# EAGLE schematic DetBackplaneSingleLayer01 (EAGLE 7.7.0)
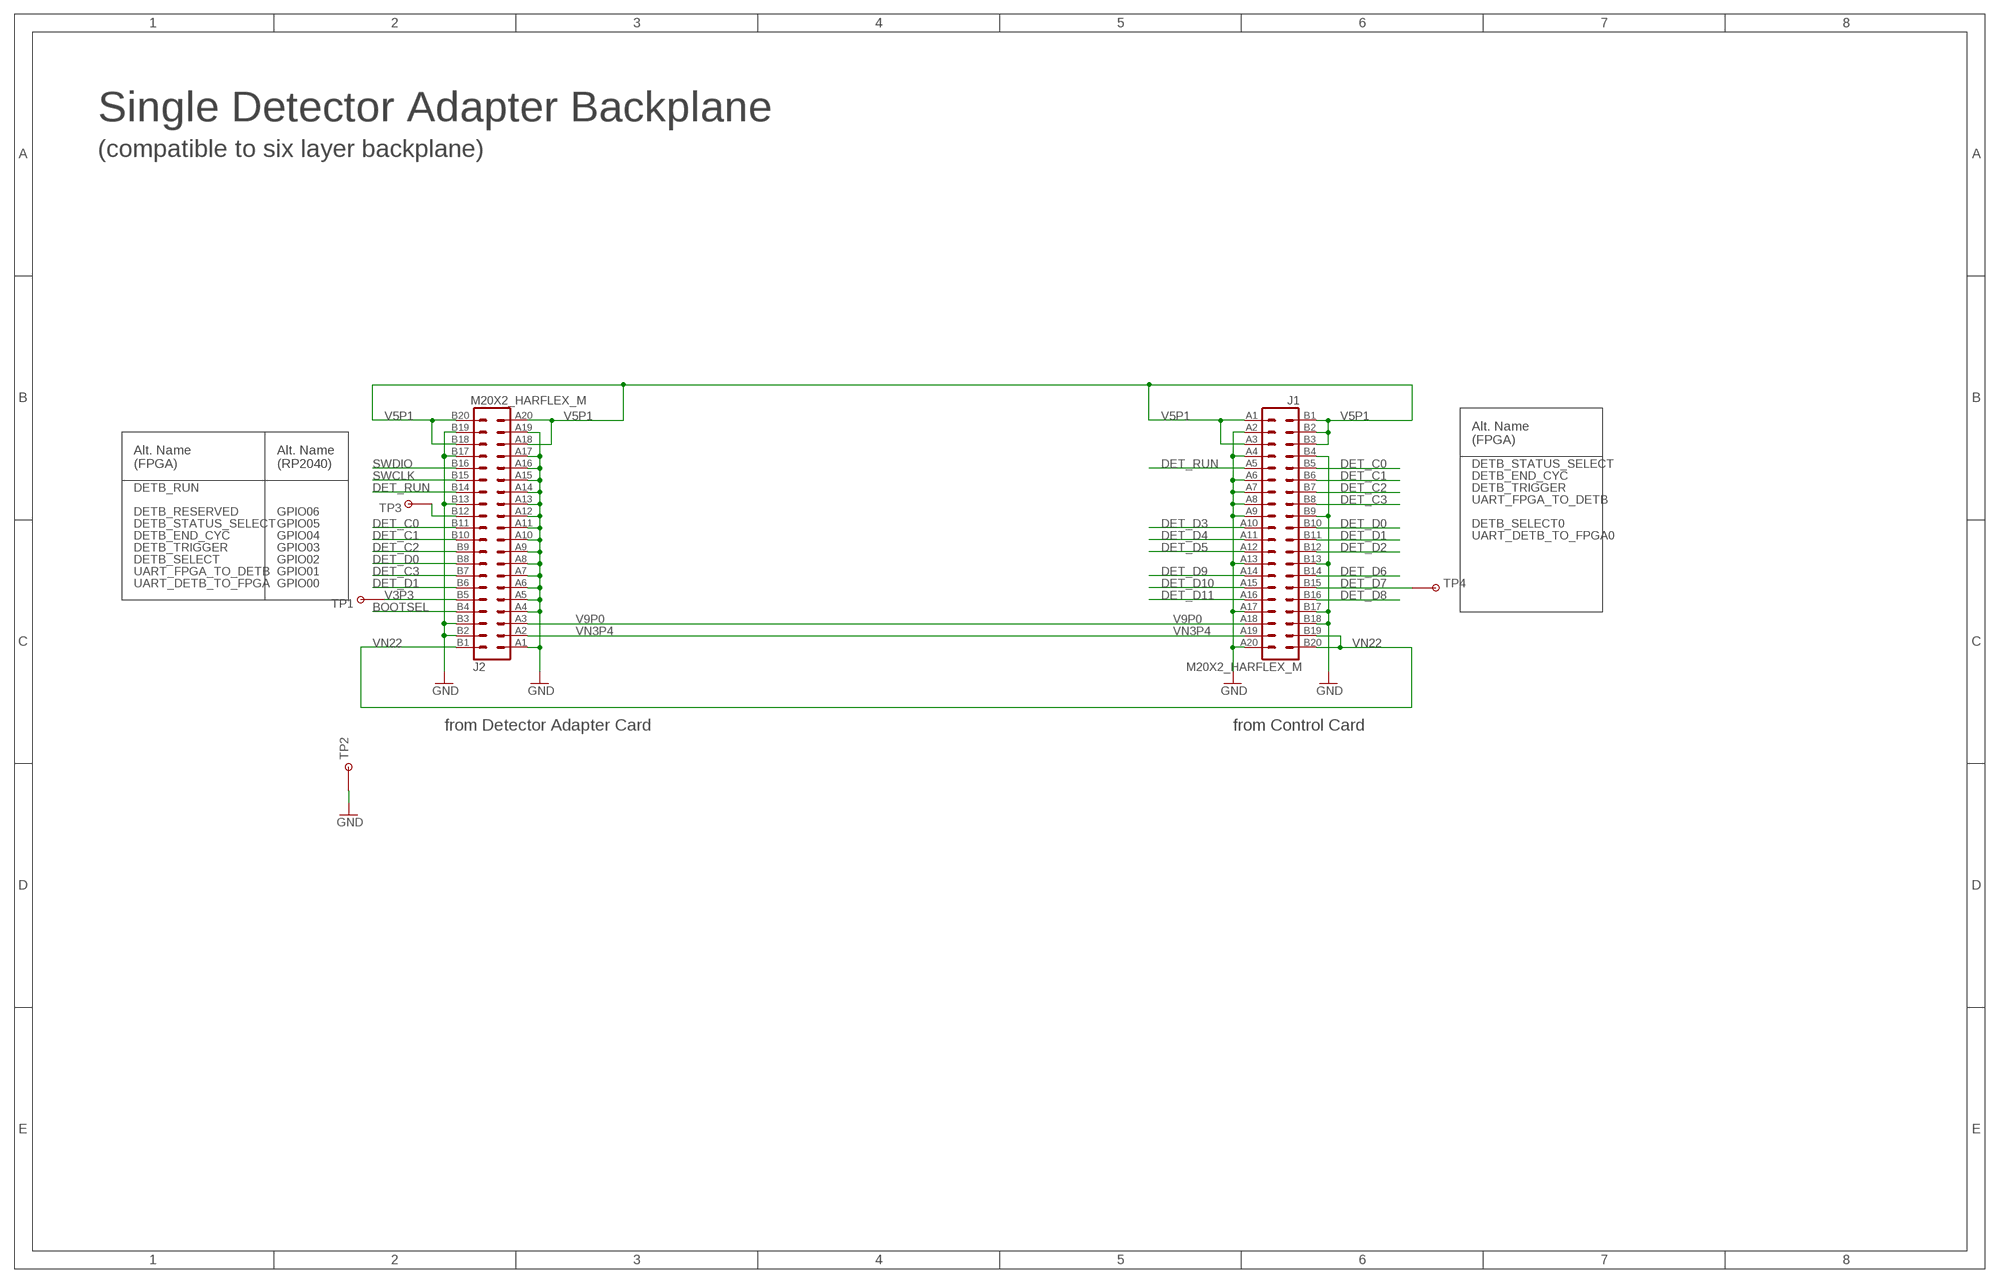
[diagram p0: schematic, sheet 1]

## Parts
J1  M20X2_HARFLEX_M  [M20X2_HARFLEX_M]
J2  M20X2_HARFLEX_M  [M20X2_HARFLEX_M]
TP1  TESTPOINT_ROUND  [TESTPAD_ROUND]
TP2  TESTPOINT1X01  [1X01]
TP3  TESTPOINT_ROUND  [TESTPAD_ROUND]
TP4  TESTPOINT_ROUND  [TESTPAD_ROUND]

## Nets
BOOTSEL: J2.B4
DET_C0: J1.B5 J2.B11
DET_C1: J1.B6 J2.B10
DET_C2: J1.B7 J2.B9
DET_C3: J1.B8 J2.B7
DET_D0: J1.B10 J2.B8
DET_D1: J1.B11 J2.B6
DET_D2: J1.B12
DET_D3: J1.A10
DET_D4: J1.A11
DET_D5: J1.A12
DET_D6: J1.B14
DET_D7: J1.B15 TP4.P$1
DET_D8: J1.B16
DET_D9: J1.A14
DET_D10: J1.A15
DET_D11: J1.A16
DET_RUN: J1.A5 J2.B14
GND: J1.A2 J1.A4 J1.A6 J1.A7 J1.A8 J1.A9 J1.A13 J1.A17 J1.A20 J1.B4 J1.B9 J1.B13 J1.B17 J1.B18 J2.A1 J2.A4 J2.A5 J2.A6 J2.A7 J2.A8 J2.A9 J2.A10 J2.A11 J2.A12 J2.A13 J2.A14 J2.A15 J2.A16 J2.A17 J2.A19 J2.B2 J2.B3 J2.B13 J2.B17 J2.B19 TP2.1
N$1: J2.B12 TP3.P$1
SWCLK: J2.B15
SWDIO: J2.B16
V3P3: J2.B5 TP1.P$1
V5P1: J1.A1 J1.A3 J1.B1 J1.B2 J1.B3 J2.A18 J2.A20 J2.B18 J2.B20
V9P0: J1.A18 J2.A3
VN3P4: J1.A19 J2.A2
VN22: J1.B19 J1.B20 J2.B1

## Notes on the sheet
- Single Detector Adapter Backplane
- (compatible to six layer backplane)
- Alt. Name
  (FPGA)
- Alt. Name
  (FPGA)
- Alt. Name
  (RP2040)
- DETB_STATUS_SELECT
- DETB_END_CYC
- DETB_RUN | DETB_TRIGGER
- UART_FPGA_TO_DETB
- DETB_RESERVED | GPIO06
- DETB_STATUS_SELECT | GPIO05 | DETB_SELECT0
- DETB_END_CYC | GPIO04 | UART_DETB_TO_FPGA0
- DETB_TRIGGER | GPIO03
- DETB_SELECT | GPIO02
- UART_FPGA_TO_DETB | GPIO01
- UART_DETB_TO_FPGA | GPIO00
- from Detector Adapter Card | from Control Card

## Library data of the parts
J1 J2 = MyLib:M20X2
TP1-TP4 = MyLib:TESTPOINT